# Altium schematic sheet [02] - Power.SchDoc
size A4
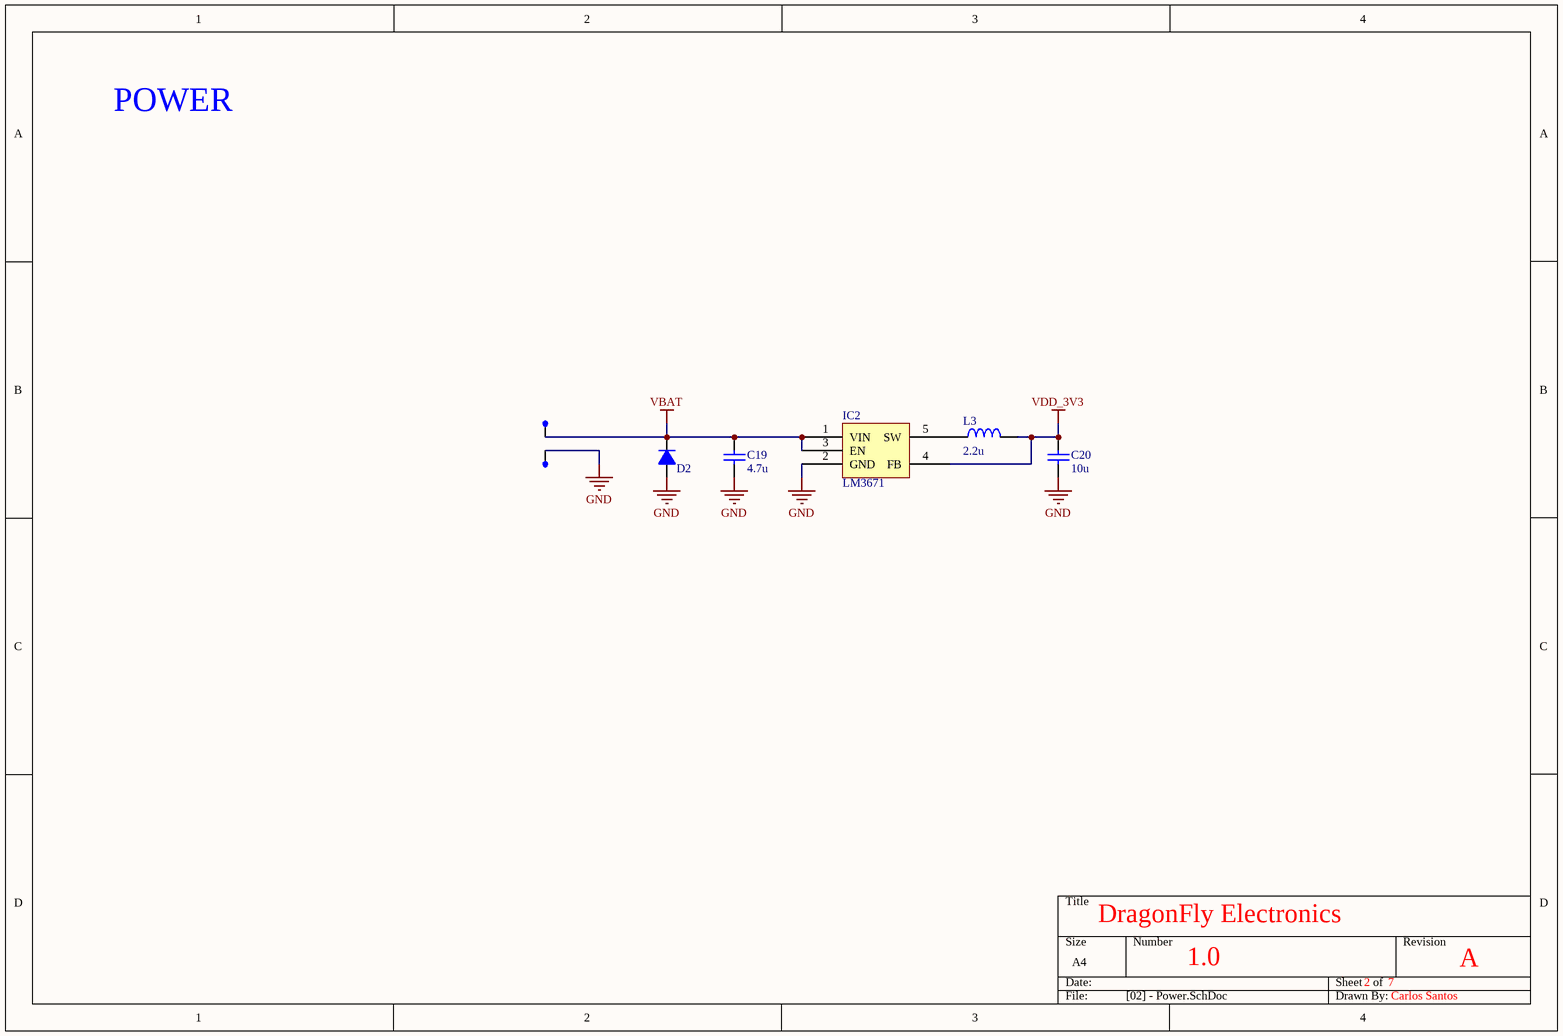
[diagram p0: [02] - Power.SchDoc]

## Parts
C19  value 4.7u  [0402 - Capacitor]  (hidden comment: Capacitor)
C20  value 10u  [0603 - Capacitor]  (hidden comment: Capacitor)
D2  Diode  [SOD 923]  (value not drawn)
IC2  LM3671  [SOT 23 - 5]
L3  value 2.2u  [MDMK2020]  (hidden comment: Inductor)
SP15  Signal Point  [Signal_point_1mm]  (value not drawn)
SP16  Signal Point  [Signal_point_1mm]  (value not drawn)

## Nets
GND: C19.1 C20.1 D2.1(A) IC2.2(GND) SP16.0(VIN)
VBAT: C19.2 D2.2(K) IC2.1(VIN) IC2.3(EN) SP15.0(VIN)
VDD_3V3: C20.2 IC2.4(FB) L3.2
NetIC2_5: IC2.5(SW) L3.1

## Notes on the sheet
- POWER
- DragonFly Electronics
- 1.0
- 2
- 7
- A
- Carlos Santos

## Library data of the parts
SP15 SP16 = Signal Point: Value: DNP
D2 = Diode: DigiKey Part #: *
IC2 = LM3671: DigiKey Part #: LM3671MF-3.3/NOPBCT-ND